# Altium schematic sheet 01_Index page.SchDoc: FIT FOR PURPOSE DEVICE
size B; Date: OCTOBER 16, 2020; CompanyName: ICTA; DrawnBy: Researchers; Organization: ICTA; DocumentNumber: 1 OF 21; Revision: V1.0; SheetNumber: 1; SheetTotal: 22; ImagePath: C:\Users\ReaiotV\Desktop
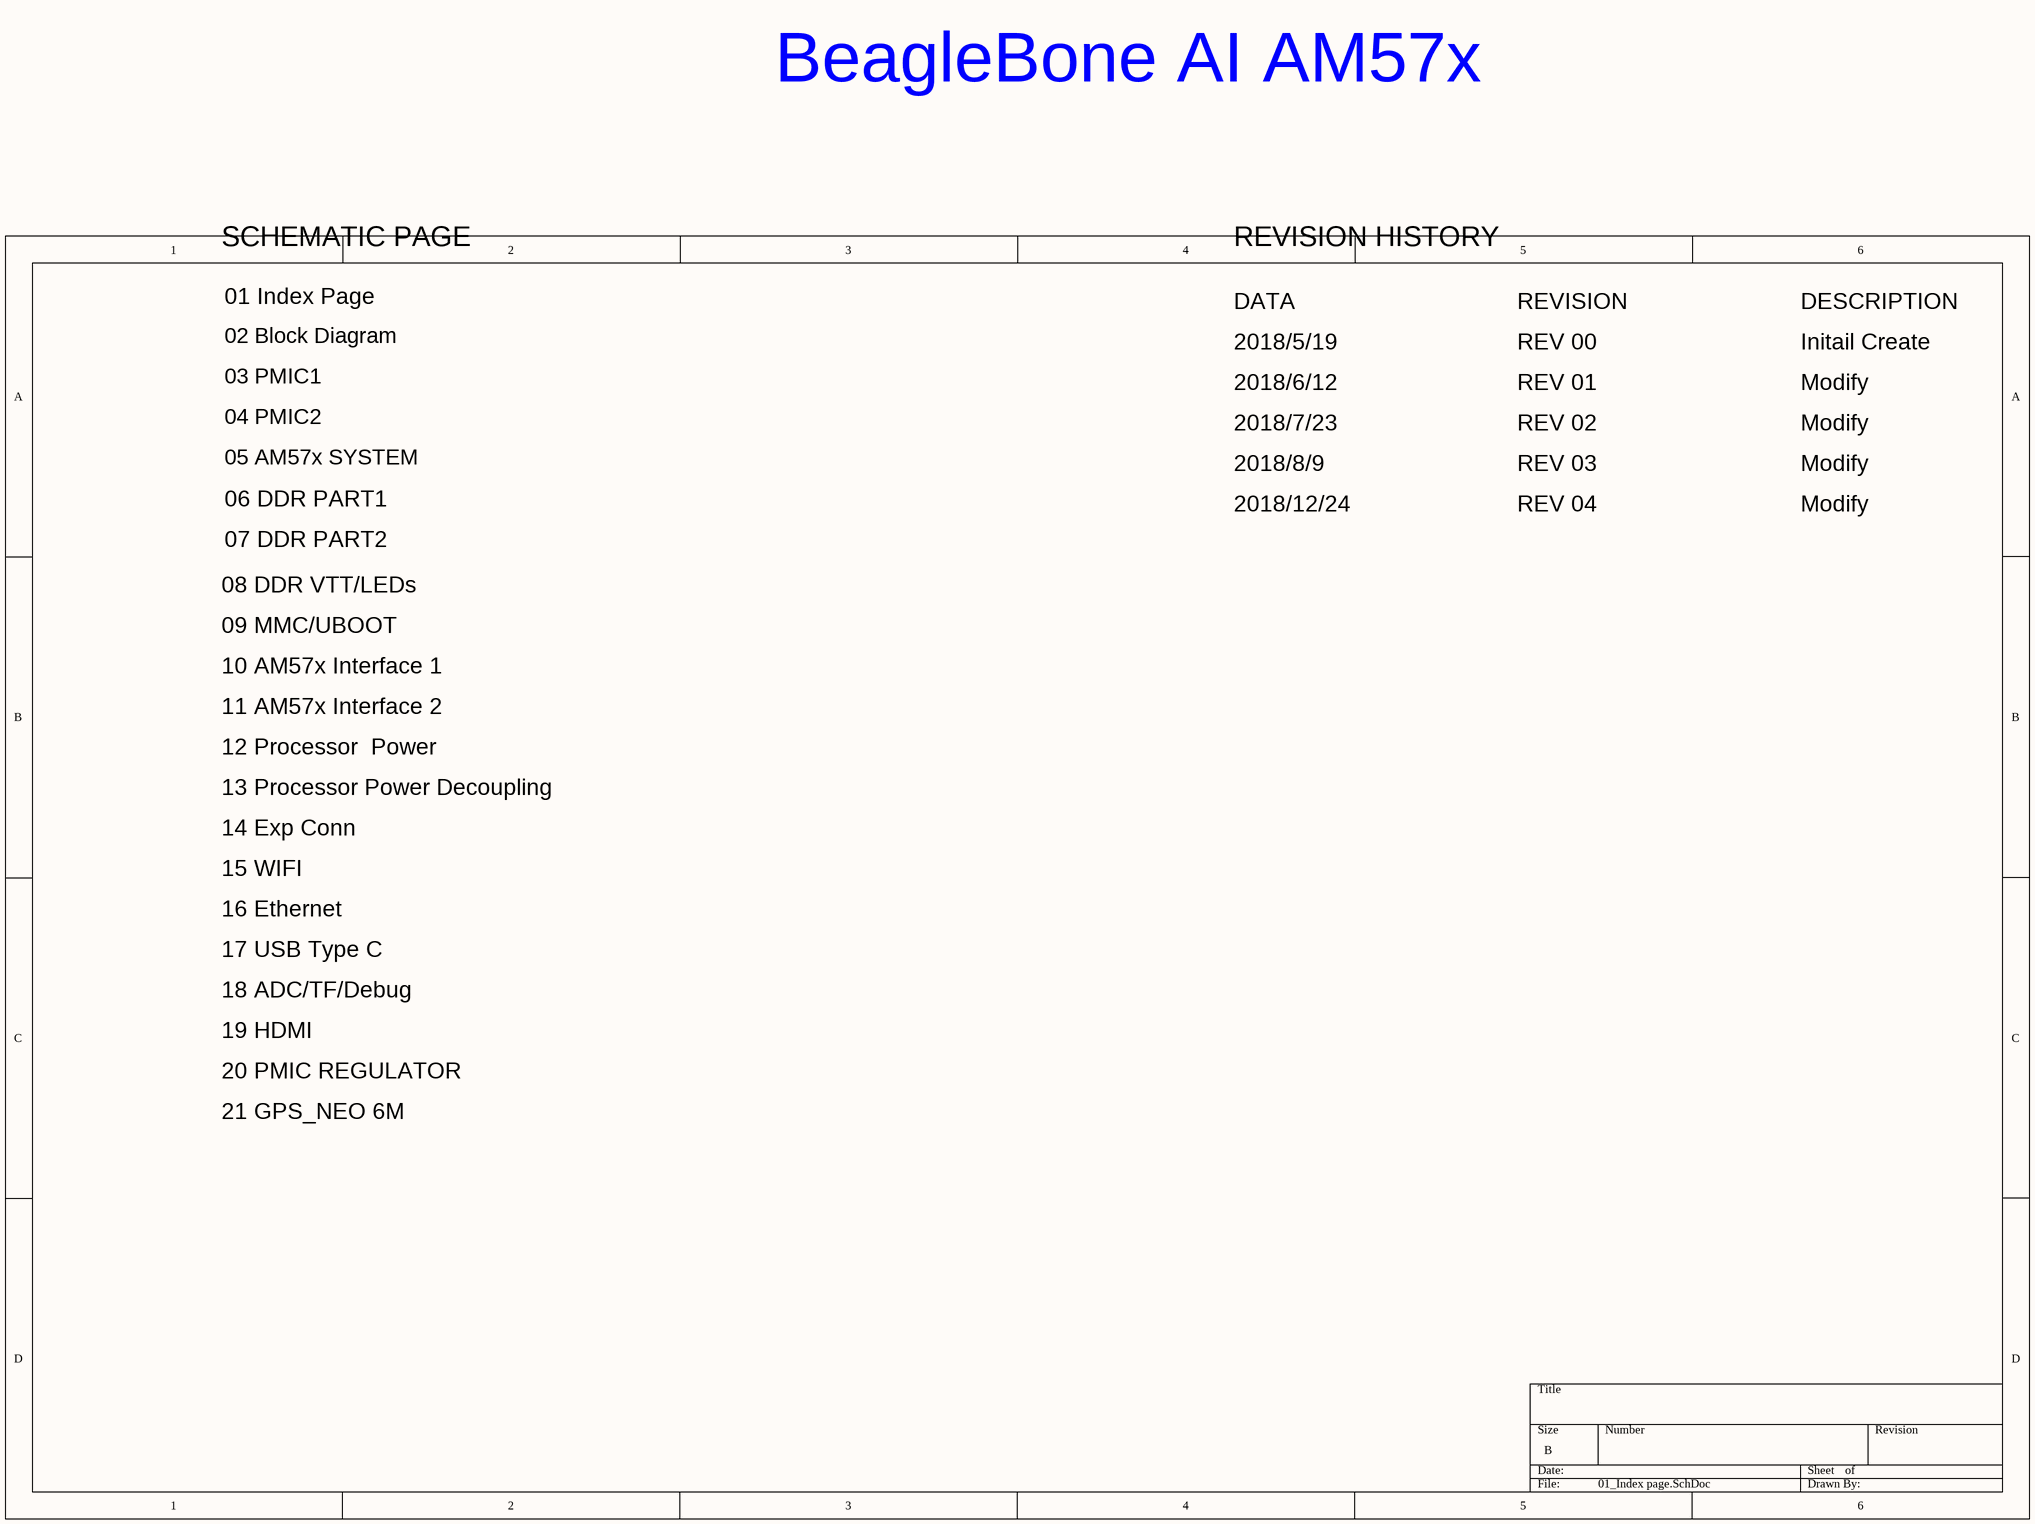
[diagram p0: 01_Index page.SchDoc]

## Notes on the sheet
- BeagleBone AI AM57x
- SCHEMATIC PAGE
- REVISION HISTORY
- 01 Index Page
- DATA
- REVISION
- DESCRIPTION
- 03 PMIC1
- 02 Block Diagram
- 2018/5/19
- 2018/6/12
- REV 00
- REV 01
- Initail Create
- Modify
- 04 PMIC2
- 05 AM57x SYSTEM
- 2018/7/23
- REV 02
- 06 DDR PART1
- 2018/8/9
- 2018/12/24
- REV 03
- REV 04
- 08 DDR VTT/LEDs
- 07 DDR PART2
- 09 MMC/UBOOT
- 10 AM57x Interface 1
- 11 AM57x Interface 2
- 13 Processor Power Decoupling
- 12 Processor  Power
- 14 Exp Conn
- 15 WIFI
- 16 Ethernet
- 17 USB Type C
- 18 ADC/TF/Debug
- 19 HDMI
- 20 PMIC REGULATOR
- 21 GPS_NEO 6M